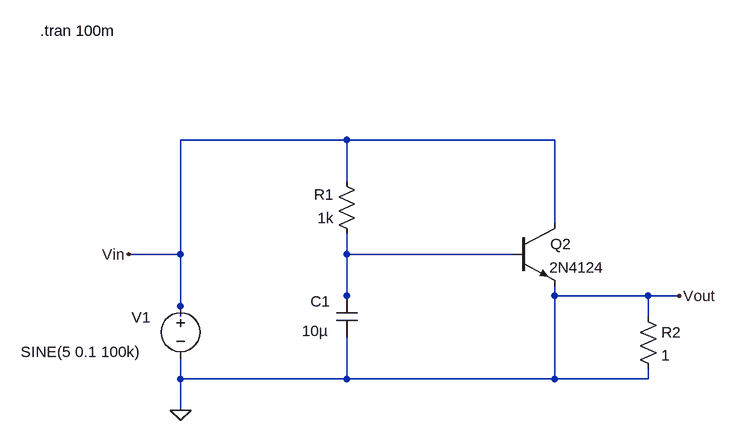
[diagram p0: schematic capacitance_multiplier.asc]
capacitance_multiplier.asc, the LTspice schematic file:
Version 4
SHEET 1 968 680
WIRE 352 -96 96 -96
WIRE 672 -96 352 -96
WIRE 352 -32 352 -96
WIRE 672 32 672 -96
WIRE 96 80 96 -96
WIRE 96 80 16 80
WIRE 352 80 352 48
WIRE 608 80 352 80
WIRE 352 144 352 80
WIRE 672 144 672 128
WIRE 816 144 672 144
WIRE 864 144 816 144
WIRE 96 160 96 80
WIRE 352 160 352 144
WIRE 96 176 96 160
WIRE 816 176 816 144
WIRE 96 272 96 240
WIRE 352 272 352 208
WIRE 352 272 96 272
WIRE 672 272 672 144
WIRE 672 272 352 272
WIRE 816 272 816 256
WIRE 816 272 672 272
WIRE 96 320 96 272
FLAG 96 320 0
FLAG 16 80 Vin
FLAG 864 144 Vout
SYMBOL voltage 96 144 R0
WINDOW 123 32 77 Left 2
WINDOW 39 0 0 Left 0
WINDOW 0 -75 33 Left 2
WINDOW 3 -246 86 Left 2
SYMATTR InstName V1
SYMATTR Value SINE(5 0.1 100k)
SYMBOL res 368 64 R180
WINDOW 0 36 76 Left 2
WINDOW 3 36 40 Left 2
SYMATTR InstName R1
SYMATTR Value 1k
SYMBOL cap 336 144 R0
WINDOW 0 -40 9 Left 2
WINDOW 3 -53 54 Left 2
SYMATTR InstName C1
SYMATTR Value 10µ
SYMBOL res 800 160 R0
SYMATTR InstName R2
SYMATTR Value 1
SYMBOL npn 608 32 R0
WINDOW 0 57 32 Left 2
SYMATTR InstName Q2
SYMATTR Value 2N4124
TEXT -120 -264 Left 2 !.tran 100m

The netlist it stands for:
* capacitance_multiplier.asc
V1 Vin 0 SINE(5 0.1 100k)
R1 N001 Vin 1k
C1 N001 0 10µ
R2 0 0 1
Q2 Vin N001 0 0 2N4124
.model NPN NPN
.model PNP PNP
.lib standard.bjt
.tran 100m
.backanno
.end